# EAGLE design HirigrandeCHINA V2.1 (EAGLE 9.6.2)
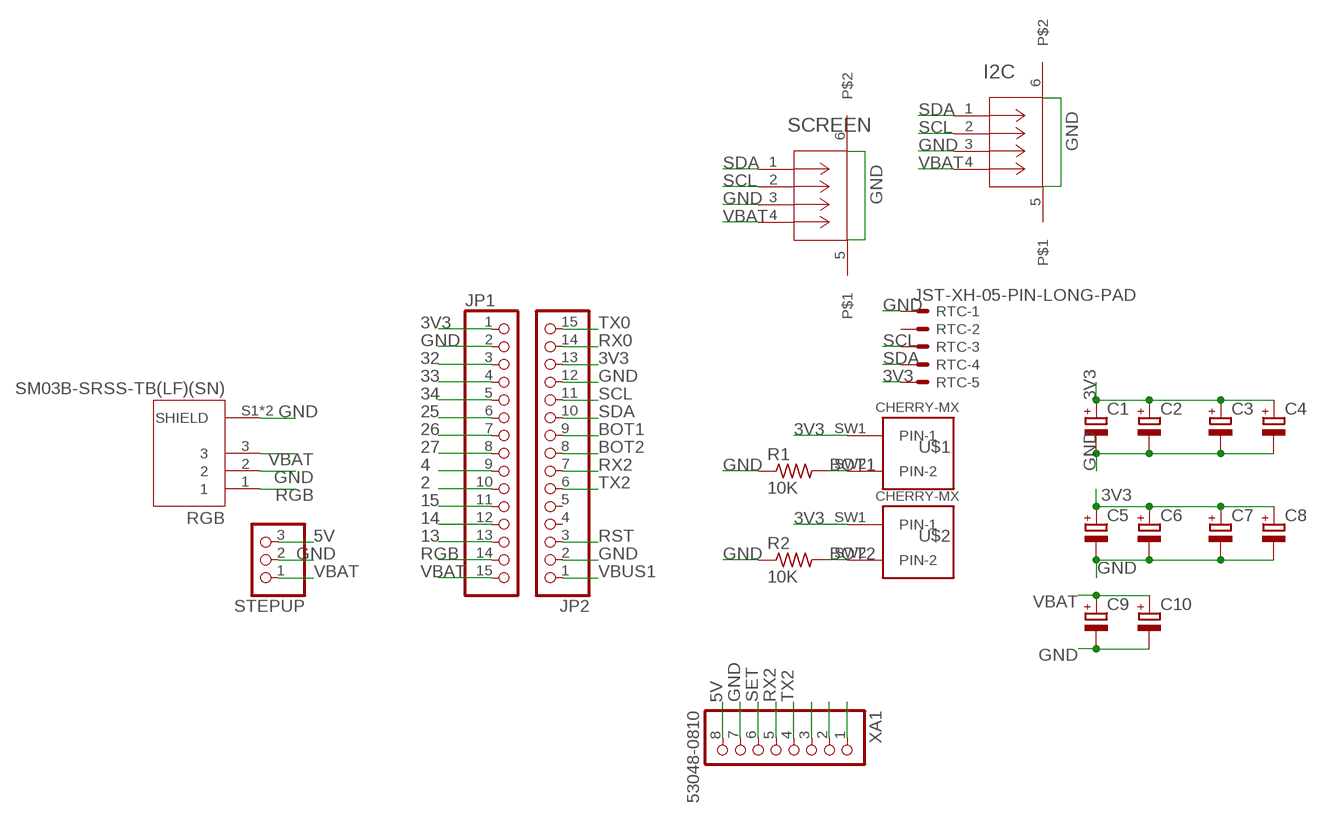
[diagram p0: schematic, sheet 1]

## Parts
C1  CPOL-EUSMCD  [SMC_D]
C2  CPOL-EUSMCD  [SMC_D]
C3  CPOL-EUSMCD  [SMC_D]
C4  CPOL-EUSMCD  [SMC_D]
C5  CPOL-EUSMCD  [SMC_D]
C6  CPOL-EUSMCD  [SMC_D]
C7  CPOL-EUSMCD  [SMC_D]
C8  CPOL-EUSMCD  [SMC_D]
C9  CPOL-EUSMCD  [SMC_D]
C10  CPOL-EUSMCD  [SMC_D]
I2C  SM04B-SRSS-TB  [CONN_SM04B-SRSS-TB_JST]
JP1  PINHD-1X15  [1X15]
JP2  PINHD-1X15  [1X15]
R1  10K  R-US_0204/7  [0204/7]
R2  10K  R-US_0204/7  [0204/7]
RGB  SM03B-SRSS-TB(LF)(SN)  [JST_SM03B-SRSS-TB(LF)(SN)]
RTC  JST-XH-05-PIN-LONG-PAD  [JST-XH-05-PACKAGE-LONG-PAD]
SCREEN  SM04B-SRSS-TB  [CONN_SM04B-SRSS-TB_JST]
STEPUP  PINHD-1X3  [1X03]
U$1  CHERRY-MX  [CHERRY-MX]
U$2  CHERRY-MX  [CHERRY-MX]
XA1  53048-0810  [MOLEX_53048-0810]

## Nets
2: JP1.10
3V3: C1.+ C2.+ C3.+ C4.+ C5.+ C6.+ C7.+ C8.+ JP1.1 JP2.13 RTC.5 U$1.SW1(PIN-1) U$2.SW1(PIN-1)
4: JP1.9
5V: STEPUP.3 XA1.8
13: JP1.13
14: JP1.12
15: JP1.11
25: JP1.6
26: JP1.7
27: JP1.8
32: JP1.3
33: JP1.4
34: JP1.5
BOT1: JP2.9 R1.2 U$1.SW2(PIN-2)
BOT2: JP2.8 R2.2 U$2.SW2(PIN-2)
GND: C1.- C2.- C3.- C4.- C5.- C6.- C7.- C8.- C9.- C10.- I2C.3 I2C.5 I2C.6 JP1.2 JP2.2 JP2.12 R1.1 R2.1 RGB.2 RGB.S1(SHIELD) RGB.S2(SHIELD) RTC.1 SCREEN.3 SCREEN.5 SCREEN.6 STEPUP.2 XA1.7
N$6: XA1.3
N$7: XA1.2
N$8: XA1.1
RGB: JP1.14 RGB.1
RST: JP2.3
RX0: JP2.14
RX2: JP2.7 XA1.5
SCL: I2C.2 JP2.11 RTC.3 SCREEN.2
SDA: I2C.1 JP2.10 RTC.4 SCREEN.1
SET: XA1.6
TX0: JP2.15
TX2: JP2.6 XA1.4
VBAT: C9.+ C10.+ I2C.4 JP1.15 RGB.3 SCREEN.4 STEPUP.1
VBUS1: JP2.1
Unconnected: JP2.4 JP2.5 RTC.2

## Library data of the parts
C1-C10 = rcl:CPOL-EU: POLARIZED CAPACITOR, European symbol; SPICEPREFIX: C
I2C SCREEN = SM04B-SRSS-TB:SM04B-SRSS-TB: Check availability <https://pricing.snapeda.com/parts/SM04B-SRSS-TB/JST%20Sales/view-part?ref=eda>; AVAILABILITY: In Stock; CHECK_PRICES: https://www.snapeda.com/parts/SM04B-SRSS-TB/JST/view-part/?ref=eda; DESCRIPTION: Connector Header Surface Mount, Right Angle 4 position 0.039 (1.00mm); MF: JST Sales; MP: SM04B-SRSS-TB; PACKAGE: None; PRICE: None; SNAPEDA_LINK: https://www.snapeda.com/parts/SM04B-SRSS-TB/JST/view-part/?ref=snap
JP1 JP2 = pinhead:PINHD-1X15: PIN HEADER
R1 R2 = adafruit:R-US_: RESISTOR, American symbol
RGB = SM03B-SRSS-TB_LF__SN_:SM03B-SRSS-TB(LF)(SN): Check availability <https://pricing.snapeda.com/parts/SM03B-SRSS-TB%28LF%29%28SN%29/JST%20Sales%20America%20Inc./view-part?ref=eda>; AVAILABILITY: In Stock; CHECK_PRICES: https://www.snapeda.com/parts/SM03B-SRSS-TB(LF)(SN)/JST/view-part/?ref=eda; DESCRIPTION: Connector Header Surface Mount, Right Angle 3 position 0.039 (1.00mm); MF: JST Sales America Inc.; MP: SM03B-SRSS-TB(LF)(SN); PACKAGE: None; PRICE: None; SNAPEDA_LINK: https://www.snapeda.com/parts/SM03B-SRSS-TB(LF)(SN)/JST/view-part/?ref=snap
RTC = Rembrandt Electronics - JST XH Connectors v1-0:JST-XH-05-PIN: JST XH Connector 2 Pin Wire to board connector. Pitch: 2,54 mm, (0.100") Number of pins: 5 Created by Rembrandt Electronics www.rembrandtelectronics.com
STEPUP = adafruit:PINHD-1X3: PIN HEADER
U$1 U$2 = cherrymx:CHERRY-MX: Cherry MX series keyswitch
XA1 = ConectorPlantower:53048-0810: 1.25mm Pitch PicoBlade Header, Right Angle, 8 Circuits Check availability <https://pricing.snapeda.com/parts/53048-0810/Molex/view-part?ref=eda>; AVAILABILITY: In Stock; CHECK_PRICES: https://www.snapeda.com/parts/53048-0810/Molex/view-part/?ref=eda; DESCRIPTION: 8 way through board PCB 90deg header | Molex Incorporated 53048-0810; MF: Molex; MP: 53048-0810; PACKAGE: None; PRICE: None; PURCHASE-URL: https://www.snapeda.com/api/url_track_click_mouser/?unipart_id=53851&manufacturer=Molex&part_name=53048-0810&search_term=picoblade 1.25mm header rightangle 8way; SNAPEDA_LINK: https://www.snapeda.com/parts/53048-0810/Molex/view-part/?ref=snap

## Board
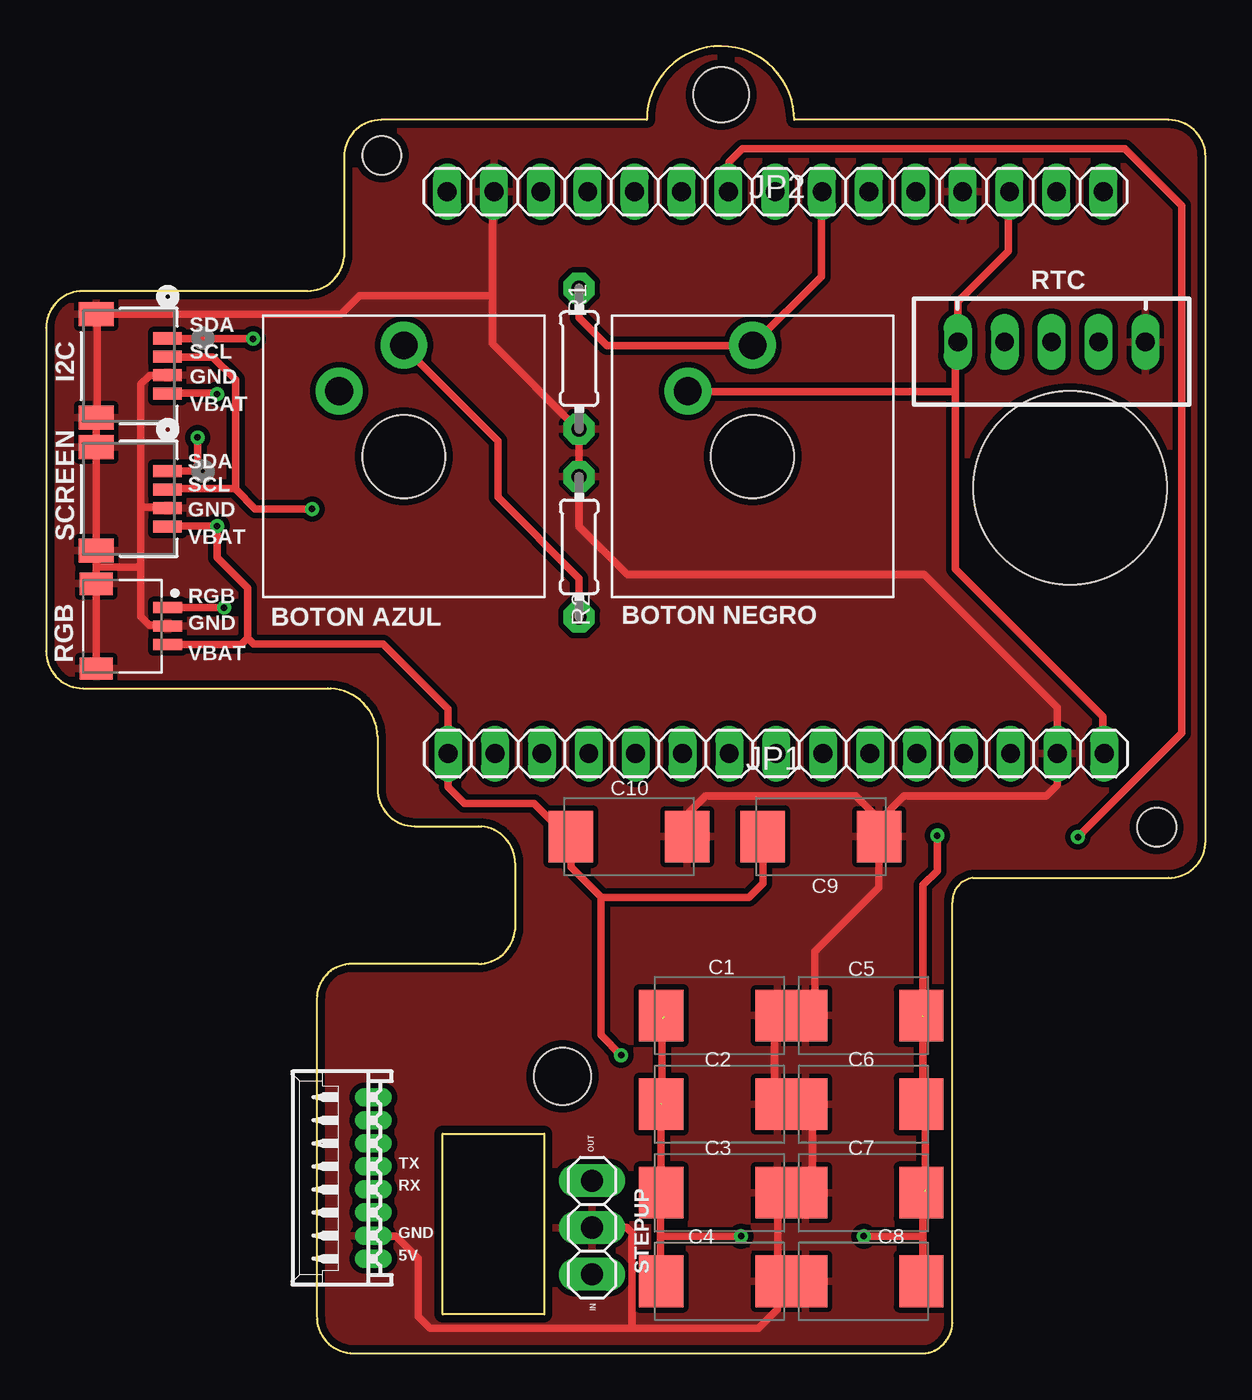
[diagram p1: board, top side]
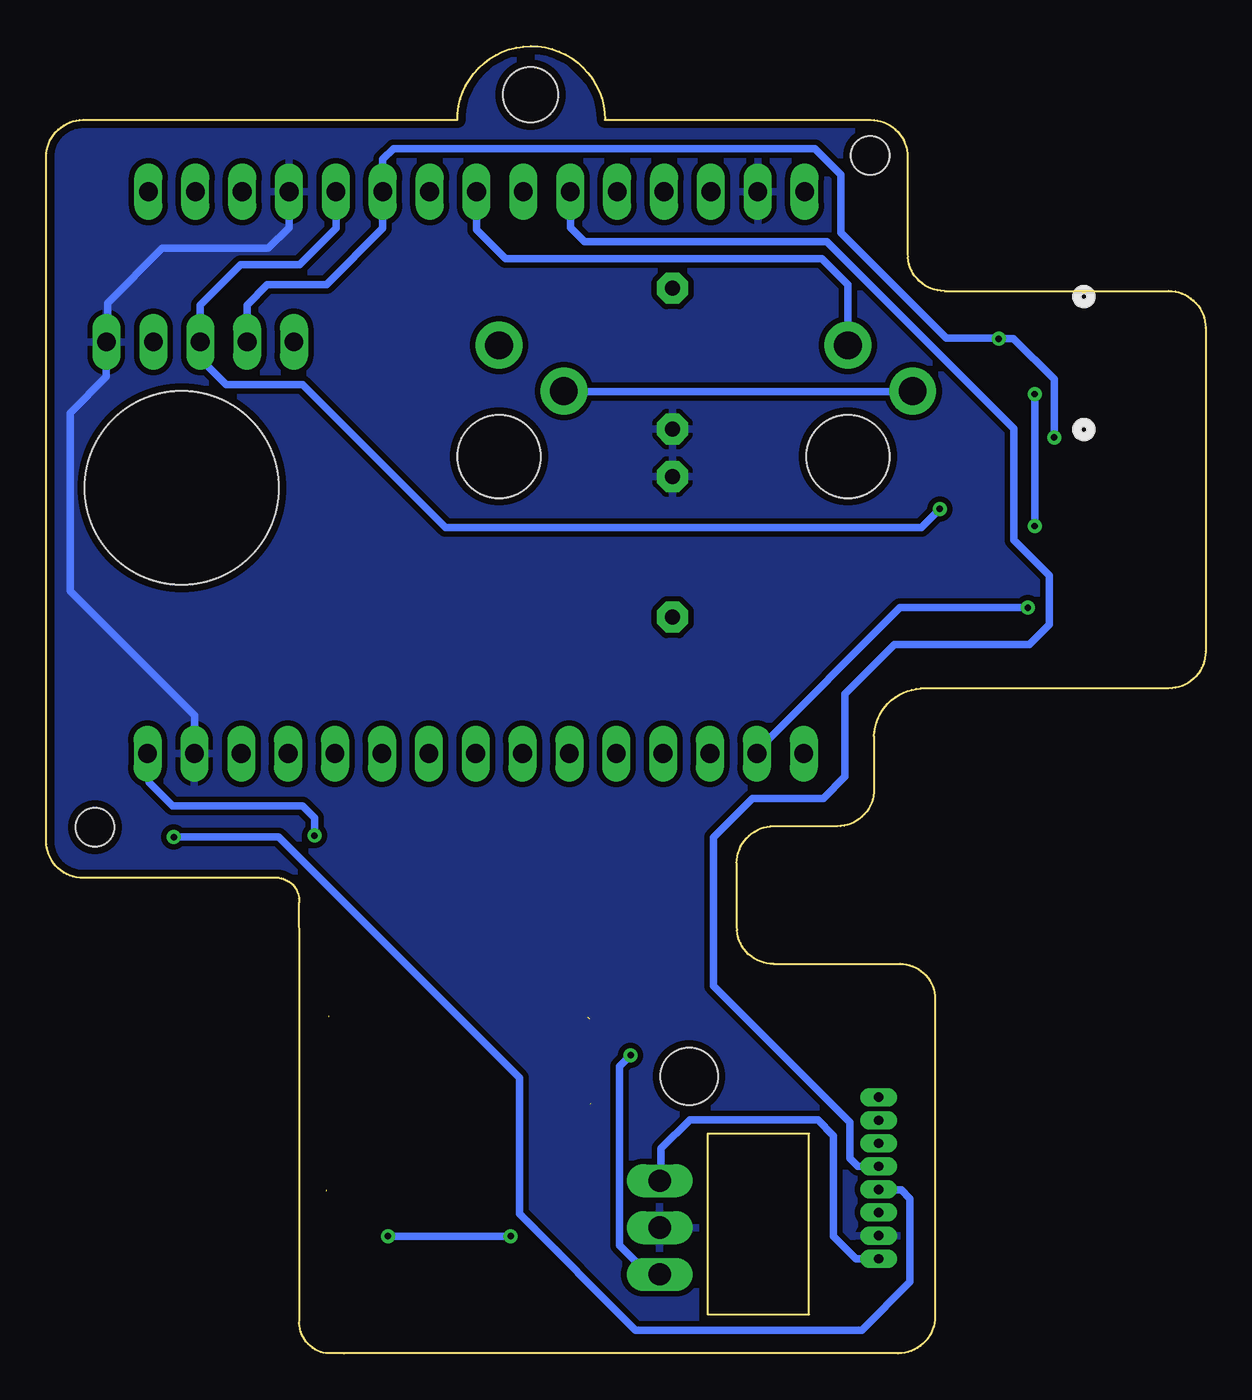
[diagram p2: board, bottom side, seen from below]

Size 62.83 x 70.84 mm. Coordinates in mm from the lower left corner, seen from the top.
Outline: 21.49,2.1 21.49,11.9 26.99,11.9 26.99,2.1 21.49,2.1
Outline: 14.15,57.57 2,57.57 1.83,57.56 arc85 0,55.57 0,38.04 arc90 2,36.04 15.26,36.04 15.44,36.03 arc-85 17.96,33.44 17.96,30.56 17.97,30.39 arc85 19.96,28.56 23.41,28.56 23.59,28.55 arc-85 25.41,26.56 25.41,23.1 25.4,22.93 arc-85 23.41,21.1 16.56,21.1 16.39,21.1 arc85 14.66,19.2 14.66,2.1 14.67,1.83 arc85 16.66,0 46.71,0 47.68,0.01 arc85 49.11,1.8 49.11,21.66 49.12,24.44 arc-85 50.21,25.76 60.83,25.76 61.01,25.77 arc85 62.83,27.76 62.83,64.84 62.83,65.01 arc85 60.83,66.84 40.55,66.84 40.53,67.18 arc175 32.55,66.84 18.15,66.84 17.98,66.83 arc85 16.15,64.84 16.15,59.57 16.14,59.39 arc-85 14.15,57.57
Copper layers (1*16): Top 0.035mm / dielectric 1.5mm / Bottom 0.035mm
Design rules "default *": minimum track width 0.4mm, minimum drill 0.35mm, track to track 0.3mm, track to pad 0.3mm, pad to pad 0.4mm, via to via 0.4mm, smd to smd 6mil, copper to edge 0.4mm, drill to drill 6mil, minimum pad ring 10mil, minimum via ring 8mil, stop-mask expansion 4mil, vias tented up to drill 0mil, thermal gap 10mil
Holes 4.5 mm at 38.29,48.6 19.39,48.6
Holes 10.5 mm at 55.49,46.9
Holes 2.1 mm at 18.19,64.9 60.19,28.5
Holes 3.1 mm at 27.99,15
Holes 3 mm at 36.59,68.2

### Footprints (pad centres in the part's own frame; a part is rotated, then mirrored left to right if it is on the bottom)
SMC_D = smd 2.4 x 2.8: + -3.15,0; - 3.15,0
CONN_SM04B-SRSS-TB_JST = smd 0.66 x 1.549: 1 1.5,-2.099; 2 0.5,-2.099; 3 -0.5,-2.099; 4 -1.5,-2.099 | smd 1.295 x 1.905: 5 -2.8,1.776; 6 2.8,1.776
1X15 = drill 1.016 long: 1 -17.78,0; 2 -15.24,0; 3 -12.7,0; 4 -10.16,0; 5 -7.62,0; 6 -5.08,0; 7 -2.54,0; 8 0,0; 9 2.54,0; 10 5.08,0; 11 7.62,0; 12 10.16,0; 13 12.7,0; 14 15.24,0; 15 17.78,0
0204/7 = drill 0.813 pad 1.676 octagon: 1 -3.81,0; 2 3.81,0
JST_SM03B-SRSS-TB(LF)(SN) = smd 0.6 x 1.55: 1 -1,0; 2 0,0; 3 1,0 | smd 1.2 x 1.8: S1 -2.3,-3.875; S2 2.3,-3.875
JST-XH-05-PACKAGE-LONG-PAD = drill 1.016 long: 1 -5.08,0; 2 -2.54,0; 3 0,0; 4 2.54,0; 5 5.08,0
1X03 = drill 1.2 pad 1.676 long: 1 -2.54,0; 2 0,0; 3 2.54,0
CHERRY-MX = drill 1.5 pad 2.54: SW1 -3.51,3.54; SW2 0,6.02 | hole 4.5: 0,0
MOLEX_53048-0810 = drill 0.5 pad 0.762 long: 1 4.375,0.02; 2 3.125,0.02; 3 1.875,0.02; 4 0.625,0.02; 5 -0.625,0.02; 6 -1.875,0.02; 7 -3.125,0.02; 8 -4.375,0.02

### Placement (x,y rotation side)
C1  36.49,18.3 0 top
C2  36.49,13.5 0 top
C3  36.49,8.7 0 top
C4  36.49,3.9 0 top
C5  44.29,18.3 180 top
C6  44.29,13.5 180 top
C7  44.29,8.7 180 top
C8  44.29,3.9 180 top
C9  41.99,28 0 top
C10  31.59,28 0 top
I2C  4.49,53.5 90 top
JP1  39.56,32.5 180 top
JP2  39.51,62.95 0 top
R1  28.89,53.9 90 top
R2  28.89,43.7 270 top
RGB  6.59,39.4 270 top
RTC  54.49,54.8 180 top
SCREEN  4.49,46.3 90 top
STEPUP  29.59,6.82 90 top
U$1  38.29,48.6 0 top
U$2  19.39,48.6 0 top
XA1  17.74,9.5 90 top

### Tracks (layer width: path | path; a pad name or v marks a point on that pad's centre or on a via)
3V3  (via drill 0.35)  (4 unrouted)
  Top 0.4: 33.29,6.35 33.29,8.65 C3.+ 33.31,8.73 33.31,13.55 | 33.29,6.35 33.29,3.95 C4.+ | 33.39,18.13 33.39,13.52 C2.+ 33.42,13.42 33.51,13.4 | 33.49,18.23 33.4,18.24 C1.+ | 47.51,6.35 47.51,8.69 C7.+ 47.64,8.78 | 47.51,6.35 47.51,3.92 C8.+ | 47.51,18.23 47.51,13.52 C6.+ 47.64,13.43 47.64,8.85 | 47.51,18.29 C5.+ 47.51,18.31 47.51,25.38 48.29,26.15 v48.29,28.05 | v37.66,6.35 33.29,6.35 | 47.51,6.35 v44.31,6.35 | 49.26,52.1 49.26,54.6 49.39,54.73 RTC.5 49.41,57 52.14,59.73 52.14,62.85 JP2.13 | 49.26,52.1 49.26,42.5 57.26,34.5 57.26,32.6 JP1.1 | 49.26,52.1 34.89,52.1 U$1.SW1
  Bottom 0.4: v44.31,6.35 v37.66,6.35 | U$2.SW1 15.89,52.1 34.76,52.1 U$1.SW1 | v48.29,28.05 48.29,29 48.94,29.65 55.99,29.65 57.26,30.93 57.26,32.48 JP1.1
5V
  Bottom 0.4: STEPUP.3 29.51,9.43 29.51,11.1 27.95,12.65 21.02,12.65 20.16,11.8 20.16,6.35 18.94,5.13 XA1.8
BOT1
  Top 0.4: R1.2 28.89,56.11 30.39,54.61 38.27,54.61 U$1.SW2 42.01,58.35 42.01,62.91 JP2.9
BOT2
  Top 0.4: R2.2 28.89,41.99 24.49,46.39 24.49,49.42 19.39,54.52 U$2.SW2
  Bottom 0.4: U$2.SW2 19.39,57.92 20.79,59.33 37.94,59.33 39.51,60.9 JP2.8
GND
  Top 0.4: R2.1 R1.1 28.8,50.09 24.19,54.7 24.19,57.32 | 31.76,1.35 38.59,1.35 39.64,2.4 C4.- | C8.- 41.54,3.98 39.29,3.98 C4.- | C4.- 39.66,3.93 39.66,8.68 C3.- 39.16,8.73 41.54,8.73 C7.- 41.54,8.85 41.54,13.35 C6.- 41.54,13.6 39.16,13.6 C2.- 39.46,13.59 39.46,18.23 C1.- C5.- 41.66,18.35 41.66,21.77 45.14,25.25 C9.- 45.14,28.85 | 2.71,42.6 RGB.S1 RGB.S2 | 2.71,42.6 SCREEN.5 SCREEN.6 I2C.5 2.76,50.85 2.76,56.23 I2C.6 15.99,56.3 16.99,57.3 24.17,57.3 24.19,57.32 | 29.04,47.1 29.02,47.88 28.79,48.11 28.79,47.61 R2.1 | 31.76,1.35 31.76,6.52 31.45,6.83 29.6,6.83 STEPUP.2 | XA1.7 17.75,6.35 18.96,6.35 20.16,5.16 20.16,2.01 20.82,1.35 31.76,1.35 | 5.14,45.93 5.21,45.85 6.39,45.85 | RGB.2 6.51,39.48 5.59,39.48 5.14,39.93 5.14,42.6 | 5.14,45.93 5.14,52.51 5.61,52.98 6.56,52.98 | 5.14,42.6 5.14,45.93 | 45.14,28.85 46.49,30.2 54.2,30.2 54.8,30.8 JP1.2 54.8,34.99 47.59,42.2 31.5,42.2 28.89,44.81 R2.1 | C10.- 34.74,29.2 35.74,30.2 43.89,30.2 45.14,28.95 45.14,28.85 | JP2.2 24.19,62.87 24.19,57.32 | 2.71,42.6 5.14,42.6
  Bottom 0.4: JP2.12 49.66,62.94 49.66,61.01 50.79,59.88 56.54,59.88 59.51,56.91 59.51,54.86 RTC.1 59.57,52.92 61.54,50.95 61.54,41.3 54.79,34.55 54.79,32.52 JP1.2
  pour Top: -0.31,37.3 -0.31,56.9 0.99,58.2 14.09,58.2 15.59,59.7 15.59,60 15.59,65.1 15.79,65.3 17.99,67.5 32.09,67.5 35.89,71.3 37.69,71.3 41.29,67.7 41.29,67.5 61.69,67.5 63.09,66.1 63.09,26.9 61.79,25.6 50.59,25.6 49.39,24.4 49.39,1.2 47.89,-0.3 47.69,-0.3 15.89,-0.3 15.59,0 14.39,1.2 14.39,19.8 15.69,21.1 15.69,21.5 23.59,21.5 25.19,23.1 25.19,26.6 23.59,28.2 19.99,28.2 17.59,30.6 17.59,33.4 15.39,35.6 1.99,35.6 1.29,35.6 -0.31,37.2
  pour Bottom: -0.41,38 -0.41,56.6 0.79,57.8 13.89,57.8 15.69,59.6 15.69,65 17.79,67.1 32.19,67.1 35.59,70.5 38.29,70.5 41.69,67.1 61.09,67.1 63.09,65.1 63.09,27.8 63.09,27.4 61.29,25.6 50.39,25.6 49.29,24.5 49.29,1 47.89,-0.4 15.99,-0.4 14.39,1.2 14.39,19.6 16.09,21.3 23.79,21.3 25.19,22.7 25.19,26.7 23.49,28.4 19.79,28.4 19.69,28.3 17.79,30.2 17.79,33.5 15.49,35.8 1.49,35.8 -0.41,37.7
RGB  (via drill 0.35)
  Top 0.4: v9.64,40.4 RGB.1
  Bottom 0.4: JP1.14 24.32,32.65 16.56,40.4 v9.64,40.4
RX2  (via drill 0.35)
  Top 0.4: JP2.7 37.01,62.99 37.01,64.54 37.75,65.27 58.45,65.27 61.54,62.19 61.54,33.6 v55.91,27.98
  Bottom 0.4: XA1.5 17.7,8.85 16.48,8.85 16.02,8.39 16.02,3.87 18.63,1.25 30.89,1.25 37.19,7.55 37.19,14.92 50.24,27.98 v55.91,27.98
SCL  (via drill 0.35)
  Top 0.4: 10.26,46.85 10.26,52.75 9.04,53.98 6.64,53.98 I2C.2 | 10.26,46.85 10.26,46.83 11.34,45.75 v14.41,45.75 | 10.26,46.85 6.63,46.85 SCREEN.2
  Bottom 0.4: v14.41,45.75 15.41,44.75 41.18,44.75 48.93,52.5 53.09,52.5 54.49,53.9 RTC.3 54.49,56.8 52.29,59 49.09,59 47.13,60.96 JP2.11
SDA  (via drill 0.35)
  Top 0.4: v8.21,49.63 8.21,48.13 7.88,47.8 SCREEN.1 | v11.21,54.98 6.61,54.98 I2C.1
  Bottom 0.4: v8.21,49.63 8.21,52.78 10.41,54.98 v11.21,54.98 11.24,55 14.05,55 19.76,60.72 19.76,63.87 21.17,65.27 44.01,65.27 44.59,64.7 JP2.10 44.59,60.96 47.65,57.9 50.85,57.9 51.95,56.8 RTC.4
TX2
  Bottom 0.4: JP2.6 34.43,61 33.66,60.23 20.52,60.23 10.39,50.1 10.39,44.07 8.46,42.14 8.46,39.5 9.55,38.4 16.86,38.4 19.54,35.73 19.54,31.26 20.71,30.08 24.55,30.08 26.68,27.96 26.68,19.92 19.29,12.53 19.29,10.58 18.84,10.13 XA1.4
VBAT  (via drill 0.35)
  Top 0.4: 10.91,38.75 10.91,41.48 9.26,43.13 v9.26,44.83 6.61,44.83 SCREEN.4 | 10.91,38.75 10.57,38.41 RGB.3 | I2C.4 6.61,52.03 9.21,52.03 v9.26,51.98 | 30.06,24.73 30.06,17.25 v31.16,16.15 | 10.91,38.75 11.24,38.43 18.26,38.43 21.78,34.91 JP1.15 21.78,30.7 22.68,29.8 26.44,29.8 28.44,27.8 | C9.+ 38.84,25.45 38.09,24.7 30.09,24.7 30.06,24.73 | C10.+ 28.44,27.8 | 28.44,27.8 28.44,26.35 30.06,24.73
  Bottom 0.4: v9.26,51.98 v9.26,44.83 | v31.16,16.15 31.76,15.55 31.76,5.85 30.18,4.28 STEPUP.1

### Text on the board
tNames: SDA | SCL | GND | VBAT | SDA | SCL | GND | VBAT | RGB | GND | BOTON AZUL | BOTON NEGRO | VBAT | OUT | TX | RX | GND | 5V | IN
tValues: + | - | +